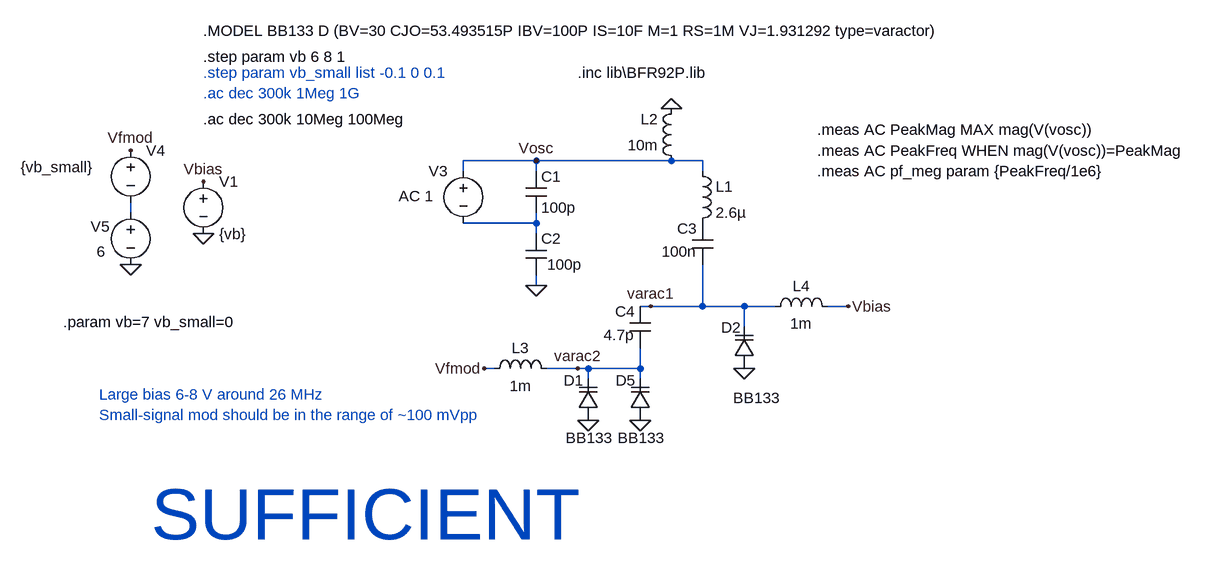
[diagram p0: schematic IF_VCO_tank_response.asc]
IF_VCO_tank_response.asc, the LTspice schematic file:
Version 4.1
SHEET 1 2860 680
WIRE 720 -96 608 -96
WIRE 928 -96 720 -96
WIRE 976 -96 928 -96
WIRE 608 -80 608 -96
WIRE 720 -80 720 -96
WIRE 976 -80 976 -96
WIRE 96 -16 96 -32
WIRE 720 0 720 -16
WIRE 720 0 608 0
WIRE 720 16 720 0
WIRE 720 96 720 80
WIRE 896 128 880 128
WIRE 976 128 976 64
WIRE 976 128 896 128
WIRE 1040 128 976 128
WIRE 1088 128 1040 128
WIRE 1200 128 1168 128
WIRE 1040 160 1040 128
WIRE 656 224 640 224
WIRE 784 224 736 224
WIRE 800 224 784 224
WIRE 880 224 880 192
WIRE 880 224 800 224
WIRE 800 240 800 224
WIRE 880 240 880 224
FLAG 208 16 0
FLAG 208 -64 Vbias
FLAG 720 -96 Vosc
FLAG 720 96 0
FLAG 1200 128 Vbias
FLAG 1040 224 0
FLAG 896 128 varac1
FLAG 880 304 0
FLAG 640 224 Vfmod
FLAG 96 -112 Vfmod
FLAG 96 64 0
FLAG 784 224 varac2
FLAG 928 -176 0
FLAG 800 304 0
SYMBOL varactor 1056 224 R180
WINDOW 0 21 63 Left 2
WINDOW 3 -39 -45 Left 2
SYMATTR InstName D2
SYMATTR Value BB133
SYMBOL voltage 208 -80 R0
WINDOW 123 0 0 Left 0
WINDOW 39 0 0 Left 0
WINDOW 3 24 97 Left 2
SYMATTR Value {vb}
SYMATTR InstName V1
SYMBOL cap 704 -80 R0
SYMATTR InstName C1
SYMATTR Value 100p
SYMBOL cap 704 16 R0
WINDOW 3 33 48 Left 2
SYMATTR Value 100p
SYMATTR InstName C2
SYMBOL cap 992 64 R180
WINDOW 0 24 56 Left 2
WINDOW 3 25 20 Left 2
SYMATTR InstName C3
SYMATTR Value 100n
SYMBOL voltage 608 -96 M0
WINDOW 123 46 54 Left 2
WINDOW 39 0 0 Left 0
SYMATTR Value2 AC 1
SYMATTR InstName V3
SYMATTR Value ""
SYMBOL ind 960 -96 R0
SYMATTR InstName L1
SYMATTR Value 2.6µ
SYMBOL cap 896 192 R180
WINDOW 0 24 56 Left 2
WINDOW 3 25 20 Left 2
SYMATTR InstName C4
SYMATTR Value 4.7p
SYMBOL varactor 864 304 M180
WINDOW 0 -22 62 Left 2
WINDOW 3 -19 -27 Left 2
SYMATTR InstName D5
SYMATTR Value BB133
SYMBOL voltage 96 -128 R0
WINDOW 3 -169 42 Left 2
WINDOW 123 0 0 Left 0
WINDOW 39 0 0 Left 0
SYMATTR Value {vb_small}
SYMATTR InstName V4
SYMBOL voltage 96 -32 M0
WINDOW 0 32 37 Left 2
WINDOW 3 39 76 Left 2
SYMATTR InstName V5
SYMATTR Value 6
SYMBOL ind 944 -80 R180
WINDOW 0 36 80 Left 2
WINDOW 3 36 40 Left 2
SYMATTR InstName L2
SYMATTR Value 10m
SYMBOL ind 640 240 R270
WINDOW 0 32 56 VTop 2
WINDOW 3 5 56 VBottom 2
SYMATTR InstName L3
SYMATTR Value 1m
SYMATTR SpiceLine Rser=10
SYMBOL ind 1072 144 R270
WINDOW 0 32 56 VTop 2
WINDOW 3 5 56 VBottom 2
SYMATTR InstName L4
SYMATTR Value 1m
SYMATTR SpiceLine Rser=10
SYMBOL varactor 784 304 M180
WINDOW 0 -22 62 Left 2
WINDOW 3 -19 -27 Left 2
SYMATTR InstName D1
SYMATTR Value BB133
TEXT 208 -256 Left 2 !.step param vb 6 8 1
TEXT -8 152 Left 2 !.param vb=7 vb_small=0
TEXT 208 -296 Left 2 !.MODEL BB133 D (BV=30 CJO=53.493515P IBV=100P IS=10F M=1 RS=1M VJ=1.931292 type=varactor)
TEXT 208 -200 Left 2 ;.ac dec 300k 1Meg 1G
TEXT 208 -232 Left 2 ;.step param vb_small list -0.1 0 0.1
TEXT 784 -232 Left 2 !.inc lib\\BFR92P.lib
TEXT 48 264 Left 2 ;Large bias 6-8 V around 26 MHz\nSmall-signal mod should be in the range of ~100 mVpp
TEXT 208 -160 Left 2 !.ac dec 300k 10Meg 100Meg
TEXT 1152 -144 Left 2 !.meas AC PeakMag MAX mag(V(vosc))
TEXT 1152 -112 Left 2 !.meas AC PeakFreq WHEN mag(V(vosc))=PeakMag
TEXT 1152 -80 Left 2 !.meas AC pf_meg param {PeakFreq/1e6}
TEXT 128 448 Left 7 ;SUFFICIENT

The netlist it stands for:
* IF_VCO_tank_response.asc
D2 0 varac1 BB133
V1 Vbias 0 {vb}
C1 Vosc N002 100p
C2 N002 0 100p
C3 varac1 P001 100n
V3 Vosc N002 AC 1
L1 Vosc P001 2.6µ
C4 varac2 varac1 4.7p
D5 0 varac2 BB133
V4 Vfmod N001 {vb_small}
V5 N001 0 6
L2 Vosc 0 10m
L3 Vfmod varac2 1m Rser=10
L4 varac1 Vbias 1m Rser=10
D1 0 varac2 BB133
.model D D
.lib standard.dio
.step param vb 6 8 1
.param vb=7 vb_small=0
.MODEL BB133 D (BV=30 CJO=53.493515P IBV=100P IS=10F M=1 RS=1M VJ=1.931292 type=varactor)
* .ac dec 300k 1Meg 1G
* .step param vb_small list -0.1 0 0.1
.inc lib\BFR92P.lib
* Large bias 6-8 V around 26 MHz
* Small-signal mod should be in the range of ~100 mVpp
.ac dec 300k 10Meg 100Meg
.meas AC PeakMag MAX mag(V(vosc))
.meas AC PeakFreq WHEN mag(V(vosc))=PeakMag
.meas AC pf_meg param {PeakFreq/1e6}
* SUFFICIENT
.backanno
.end